# Altium schematic sheet MCU152A_USB_and_Power.SchDoc
size 431 x 279 mm; Date: Not shown in title block; ApprovedBy: Not shown in title block; CheckedBy: Not shown in title block; Author: Not shown in title block; CompanyName: Not shown in title block; Engineer: Not shown in title block; Organization: Not shown in title block; Address1: Not shown in title block; Address2: Not shown in title block; Address3: Not shown in title block; Address4: Not shown in title block; DocumentNumber: 6; Revision: Use project parameter SCH_Rev; SheetNumber: 6; SheetTotal: 8; PageSetup: Record=PageOptions|CenterHorizontal=True|CenterVertical=True|PrintScale=1.00|XCorrection=1.00|YCorrection=1.00|PrintKind=0|BorderSize=5000000|LeftOffset=0|BottomOffset=0|Orientation=2|PaperLength=1000|PaperWidth=1000|Scale=100|PaperSource=15|PrintQuality=600|MediaType=1|DitherType=10|PaperKind=Letter|PrintScaleMode=1; CurrentTime: Not shown in title block; CurrentDate: Not shown in title block; Time: Not shown in title block; DocumentFullPathAndName: Not shown in title block; DocumentName: Not shown in title block; ModifiedDate: Not shown in title block; ImagePath: Not shown in title block
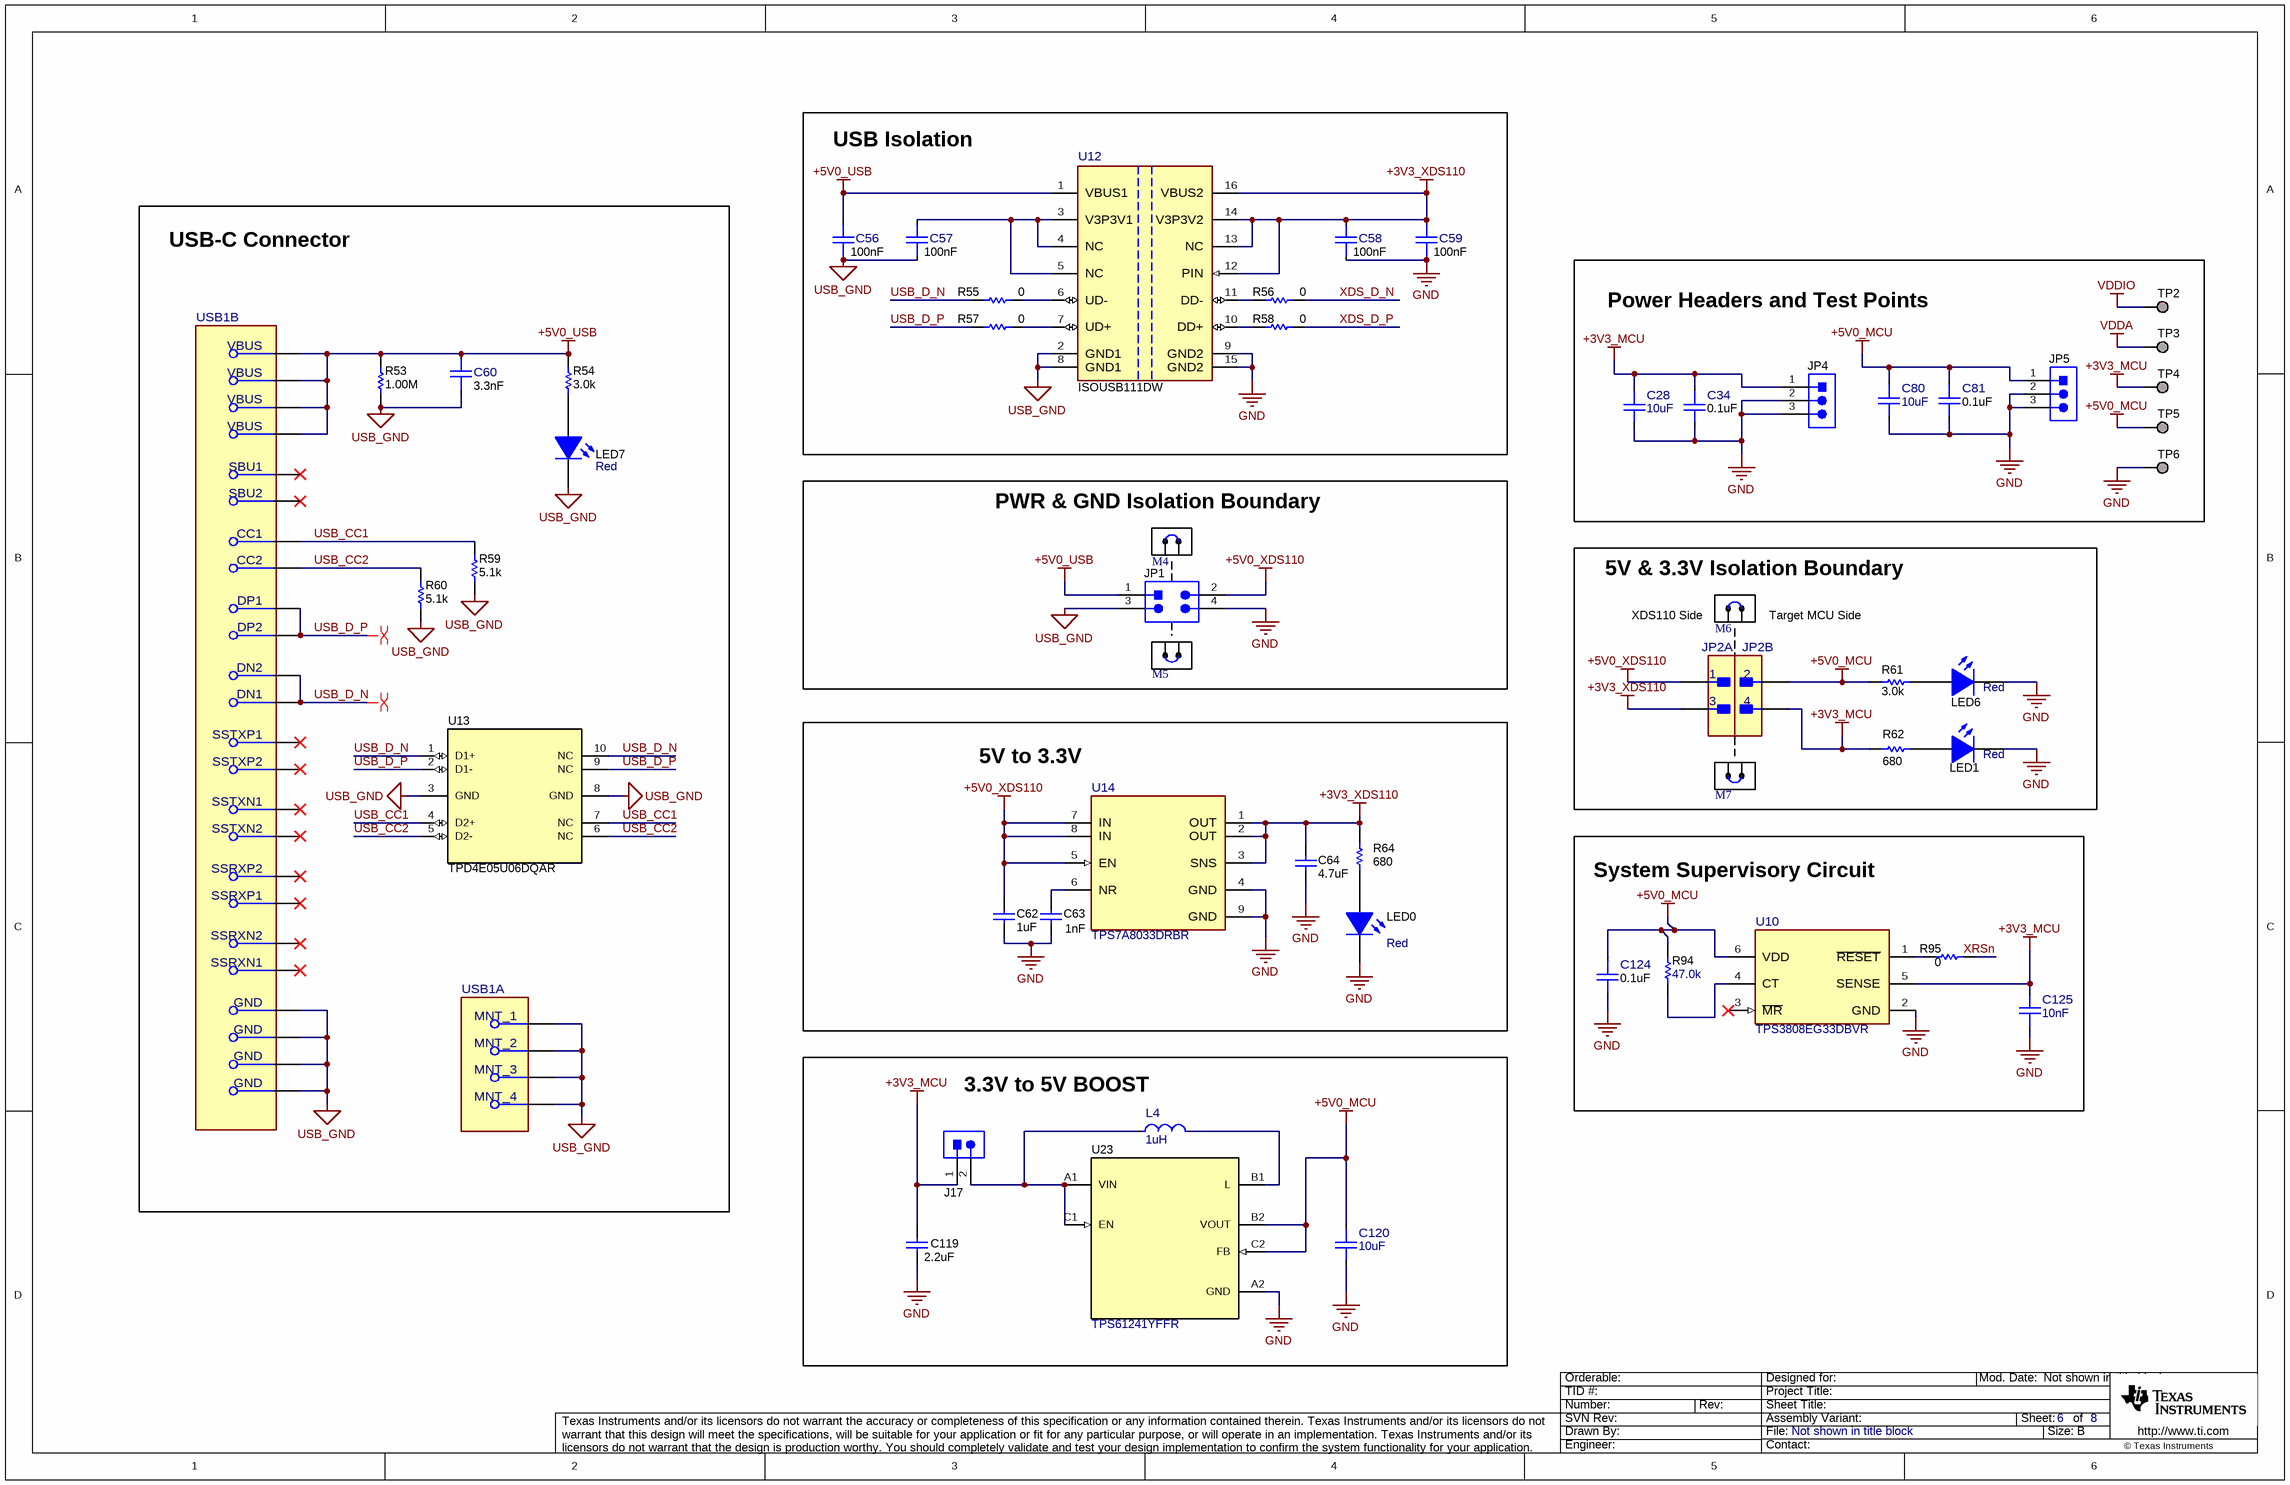
[diagram p0: MCU152A_USB_and_Power.SchDoc]

## Parts
C28  ValueDisplayed: 10uF  [FP-885012106031_0603-MFG]  (hidden comment: 885012106031)
C34  ValueDisplayed: 0.1uF  [FP-885012205018_0402-MFG]  (hidden comment: 885012205018)
C56  Cap_F: 100nF  [FP-885012205018_0402-MFG]  (hidden comment: 885012205018)
C57  Cap_F: 100nF  [FP-885012205018_0402-MFG]  (hidden comment: 885012205018)
C58  Cap_F: 100nF  [FP-885012205018_0402-MFG]  (hidden comment: 885012205018)
C59  Cap_F: 100nF  [FP-885012205018_0402-MFG]  (hidden comment: 885012205018)
C60  ValueDisplayed: 3.3nF  [FP-885012205064_0402-MFG]  (hidden comment: 885012205064)
C62  ValueDisplayed: 1uF  [0402]  (hidden comment: 885012105012)
C63  Cap_F: 1nF  [0402]  (hidden comment: 885012205061)
C64  ValueDisplayed: 4.7uF  [0402_065]  (hidden comment: C1005X5R1A475K050BC)
C80  ValueDisplayed: 10uF  [FP-885012106031_0603-MFG]  (hidden comment: 885012106031)
C81  ValueDisplayed: 0.1uF  [FP-885012205018_0402-MFG]  (hidden comment: 885012205018)
C119  ValueDisplayed: 2.2uF  [0603]  (hidden comment: 885012106018)
C120  ValueDisplayed: 10uF  [FP-885012106031_0603-MFG]  (hidden comment: 885012106031)
C124  ValueDisplayed: 0.1uF  [FP-885012205018_0402-MFG]  (hidden comment: 885012205018)
C125  Cap_F: 10nF  [FP-885012206040_0603-MFG]  (hidden comment: 885012206040)
J17  61300211121  [WURTH_61300211121]  (value not drawn)
JP1  TSM-102-01-L-DV  [Samtec_TSM-102-01-x-DV]  (value not drawn)
JP2  61300421121  [FP-61300421121_HDR4-MFG]  (value not drawn)  (parts A,B of 2)
JP4  61300311121  [WURTH_61300311121]  (value not drawn)
JP5  61300311121  [WURTH_61300311121]  (value not drawn)
L4  value 1uH  [FP-74479773210_0805-MFG]  (hidden comment: 74479773210)
LED0  value Red  [WL-SMCW_RED_0805]  (hidden comment: 150080SS75000)
LED1  value Red  [WL-SMCW_RED_0805]  (hidden comment: 150080SS75000)
LED6  value Red  [WL-SMCW_RED_0805]  (hidden comment: 150080SS75000)
LED7  value Red  [WL-SMCW_RED_0805]  (hidden comment: 150080SS75000)
M4  60900213421  [Wurth_60900213421]  (value not drawn)
M5  60900213421  [Wurth_60900213421]  (value not drawn)
M6  60900213421  [Wurth_60900213421]  (value not drawn)
M7  60900213421  [Wurth_60900213421]  (value not drawn)
R53  ValueDisplayed: 1.00M  [0402]  (hidden comment: CRCW04021M00FKED)
R54  ValueDisplayed: 3.0k  [0603]  (hidden comment: RC0603JR-073KL)
R55  ValueDisplayed: 0  [0402]  (hidden comment: RC0402JR-070RL)
R56  ValueDisplayed: 0  [0402]  (hidden comment: RC0402JR-070RL)
R57  ValueDisplayed: 0  [0402]  (hidden comment: RC0402JR-070RL)
R58  ValueDisplayed: 0  [0402]  (hidden comment: RC0402JR-070RL)
R59  ValueDisplayed: 5.1k  [0603]  (hidden comment: RC0603JR-075K1L)
R60  ValueDisplayed: 5.1k  [0603]  (hidden comment: RC0603JR-075K1L)
R61  ValueDisplayed: 3.0k  [0603]  (hidden comment: RC0603JR-073KL)
R62  ValueDisplayed: 680  [0402]  (hidden comment: CRCW0402680RJNED)
R64  ValueDisplayed: 680  [0402]  (hidden comment: CRCW0402680RJNED)
R94  ValueDisplayed: 47.0k  [0603]  (hidden comment: RC0603FR-0747KL)
R95  ValueDisplayed: 0  [0603]  (hidden comment: ERJ-3GEY0R00V)
TP2  TESTPOINT  [TP_50MIL-25MILHOLE]  (value not drawn)  (no BOM)
TP3  TESTPOINT  [TP_50MIL-25MILHOLE]  (value not drawn)  (no BOM)
TP4  TESTPOINT  [TP_50MIL-25MILHOLE]  (value not drawn)  (no BOM)
TP5  TESTPOINT  [TP_50MIL-25MILHOLE]  (value not drawn)  (no BOM)
TP6  TESTPOINT  [TP_50MIL-25MILHOLE]  (value not drawn)  (no BOM)
U10  TPS3808EG33DBVR  [DBV0006A-MFG]
U12  ISOUSB111DW  [DW0016B-MFG]
U13  TPD4E05U06DQAR  [DQA0010A]
U14  TPS7A8033DRBR  [DRB0008A-MFG]
U23  TPS61241YFFR  [YFF0006AEAE]
USB1  MUP-U22001  [FP-MUP-U22001_CONN_USB_8MM94_8MM0-MFG]  (value not drawn)  (parts A,B of 2)

## Blocks framed on the sheet
USB Isolation: C56-C59 R55-R58 U12
USB-C Connector: C60 LED7 R53 R54 R59 R60 U13 USB1
Power Headers and Test Points: C28 C34 C80 C81 JP4 JP5 TP2-TP6
PWR & GND Isolation Boundary: JP1 M4 M5
5V & 3.3V Isolation Boundary: JP2 LED1 LED6 M6 M7 R61 R62
5V to 3.3V: C62-C64 LED0 R64 U14
System Supervisory Circuit: C124 C125 R94 R95 U10
3.3V to 5V BOOST: C119 C120 J17 L4 U23

## Nets
+3V3_MCU: C28.1 C34.1 C119.1 C125.2 J17.1 JP2.4 JP4.1 R62.2 TP4.1 U10.5(SENSE)
+3V3_XDS110: C58.2 C59.2 C64.1 JP2.3 R64.2 U12.12(PIN) U12.13(NC) U12.14(V3P3V2) U12.16(VBUS2) U14.1(OUT) U14.2(OUT) U14.3(SNS)
+5V0_MCU: C80.1 C81.1 C120.1 C124.1 JP2.2 JP5.1 R61.2 R94.2 TP5.1 U10.6(VDD) U23.B2(VOUT) U23.C2(FB)
+5V0_USB: C56.2 C60.2 JP1.1 R53.2 R54.2 U12.1(VBUS1) USB1.A4(VBUS) USB1.A9(VBUS) USB1.B4(VBUS) USB1.B9(VBUS)
+5V0_XDS110: C62.1 JP1.2 JP2.1 U14.5(EN) U14.7(IN) U14.8(IN)
GND: C28.2 C34.2 C58.1 C59.1 C62.2 C63.2 C64.2 C80.2 C81.2 C119.2 C120.2 C124.2 C125.1 JP1.4 JP4.2 JP4.3 JP5.2 JP5.3 LED0.1(K) LED1.1(K) LED6.1(K) TP6.1 U10.2(GND) U12.9(GND2) U12.15(GND2) U14.4(GND) U14.9(GND) U23.A2(GND)
USB_GND: C56.1 C57.1 C60.1 JP1.3 LED7.1(K) R53.1 R59.1 R60.1 U12.2(GND1) U12.8(GND1) U13.3(GND) U13.8(GND) USB1.1(MNT_1) USB1.2(MNT_2) USB1.3(MNT_3) USB1.4(MNT_4) USB1.A1(GND) USB1.A12(GND) USB1.B1(GND) USB1.B12(GND)
VDDA: TP3.1
VDDIO: TP2.1
USB_CC1: R59.2 U13.4(D2+) U13.7(NC) USB1.A5(CC1)
USB_CC2: R60.2 U13.5(D2-) U13.6(NC) USB1.B5(CC2)
USB_D_N: R55.1 U13.1(D1+) U13.10(NC) USB1.A7(DN1) USB1.B7(DN2)
USB_D_P: R57.1 U13.2(D1-) U13.9(NC) USB1.A6(DP1) USB1.B6(DP2)
XDS_D_N: R56.2
XDS_D_P: R58.2
XRSn: R95.1
NetC57_2: C57.2 U12.3(V3P3V1) U12.4(NC) U12.5(NC)
NetC63_1: C63.1 U14.6(NR)
NetJ17_2: J17.2 L4.1 U23.A1(VIN) U23.C1(EN)
NetL4_2: L4.2 U23.B1(L)
NetLED0_2: LED0.2(A) R64.1
NetLED1_2: LED1.2(A) R62.1
NetLED6_2: LED6.2(A) R61.1
NetLED7_2: LED7.2(A) R54.1
NetR55_2: R55.2 U12.6(UD-)
NetR56_1: R56.1 U12.11(DD-)
NetR57_2: R57.2 U12.7(UD+)
NetR58_1: R58.1 U12.10(DD+)
NetR94_1: R94.1 U10.4(CT)
NetR95_2: R95.2 U10.1(~{RESET})

Not connected (* = marked no-connect by the designer): U10 3(~{MR})*; USB1 A2(SSTXP1)* A3(SSTXN1)* A8(SBU1)* A10(SSRXN2)* A11(SSRXP2)* B2(SSTXP2)* B3(SSTXN2)* B8(SBU2)* B10(SSRXN1)* B11(SSRXP1)*

## Layout directives
differential pair: USB_D_N, USB_D_P

## Notes on the sheet
- XDS110 Side
- (near M6) Target MCU Side
- Drawn By:
- SVN Rev:
- Number:
- TID #:
- Orderable:
- Rev:
- Sheet Title:
- File:
- Project Title:
- Designed for:
- Assembly Variant:
- Mod. Date:
- Sheet:
- Size:
- of
- B
- http://www.ti.com
- Texas Instruments and/or its licensors do not warrant the accuracy or completeness of this specification or any information contained therein. Texas Instruments and/or its licensors do not warrant that this design will meet the specifications, will be suitable for your application or fit for any particular purpose, or will operate in an implementation. Texas Instruments and/or its licensors do not warrant that the design is production worthy. You should completely validate and test your design implementation to confirm the system functionality for your application.
- Engineer:
- Contact:
- © Texas Instruments

## Library data of the parts
C28 C80 C120 = CMP-0124926-1: 10 µF ±20% 25V Ceramic Capacitor X5R 0603 (1608 Metric); Manufacturer: Wurth; AEC Qualified: No; Cap_F: 10µF; SizeZ_mm: 1mm; TempCo: 15%; Value: 10µF; PackageReference: 0603; PartNumber: 885012106031; RoHS: TRUE; Tolerance_%: 20%; VDC_V: 25V; Part Number: 885012106031; datasheet: https://www.we-online.com/katalog/datasheet/885012106031.pdf; Datasheet Path: datasheets/Cap-885012106031.pdf; helpURL: https://upverter.com/upn/revision/3eb71e8268f7dbaa/; Lead Free: Yes; Operating Temperature Range: -55°C to +85°C; Temperature Characteristic: X5R; ComponentLink1Description: Datasheet; ComponentLink1URL: https://www.we-online.com/katalog/datasheet/885012106031.pdf
C34 C81 C124 = CMP-0090362-1: 0.1µF ±10% 10V Ceramic Capacitor X7R 0402 (1005 Metric); Manufacturer: Wurth Electronics; AEC Qualified: No; Value: 100nF; SizeZ_mm: 0.55mm; TempCo: 15%; RoHS: TRUE; Tolerance_%: 10%; datasheet: https://www.we-online.com/catalog/datasheet/885012205018.pdf; Lead Free: Yes; Operating Temperature Range: -55°C to +125°C; ComponentLink1Description: Datasheet; Digikey Description: CAP CER 0.1UF 10V X7R 0402; Supplier Part Number 1: 732-7513-1-ND; Supplier 2: Mouser; Mouser Part Number: 710-885012205018; Digikey Part Number: 732-7513-1-ND; Temperature Characteristic: X7R; Supplier 1: Digikey; Datasheet Path: datasheets/Cap-885012205018.pdf; ComponentLink1URL: https://www.we-online.com/catalog/datasheet/885012205018.pdf; VDC_V: 10V; Supplier Part Number 2: 710-885012205018; Cap_F: 100nF; PackageReference: 0402; PartNumber: 885012205018; Part Number: 885012205018; helpURL: https://upverter.com/upn/revision/1acbe355db19639d/
C56-C59 = CMP-0090362-1: 0.1µF ±10% 10V Ceramic Capacitor X7R 0402 (1005 Metric); Manufacturer: Wurth Electronics; AEC Qualified: No; Value: 100nF; SizeZ_mm: 0.55mm; ValueDisplayed: 100000pF; TempCo: 15%; RoHS: TRUE; Tolerance_%: 10%; datasheet: https://www.we-online.com/catalog/datasheet/885012205018.pdf; Lead Free: Yes; Operating Temperature Range: -55°C to +125°C; ComponentLink1Description: Datasheet; Digikey Description: CAP CER 0.1UF 10V X7R 0402; Supplier Part Number 1: 732-7513-1-ND; Supplier 2: Mouser; Mouser Part Number: 710-885012205018; Digikey Part Number: 732-7513-1-ND; Temperature Characteristic: X7R; Supplier 1: Digikey; Datasheet Path: datasheets/Cap-885012205018.pdf; ComponentLink1URL: https://www.we-online.com/catalog/datasheet/885012205018.pdf; VDC_V: 10V; Supplier Part Number 2: 710-885012205018; PackageReference: 0402; PartNumber: 885012205018; Part Number: 885012205018; helpURL: https://upverter.com/upn/revision/1acbe355db19639d/
C60 = CMP-0092424-1: Cap Cer 3300pF 50V X7R 0402; Manufacturer: Wurth Electronics; TempCo: 15%; AEC Qualified: No; Value: 3.3nF; SizeZ_mm: 0.55mm; Tolerance_%: 10%; Part Number: 885012205064; Supplier 2: Mouser; RoHS: TRUE; Lead Free: Yes; ComponentLink1Description: Datasheet; Cap_F: 3.3nF; Supplier 1: Digikey; Digikey Description: CAP CER 3300PF 50V X7R 0402; Digikey Part Number: 732-7559-1-ND; Temperature Characteristic: X7R; Operating Temperature Range: -55°C to +125°C; Supplier Part Number 2: 710-885012205064; Datasheet Path: datasheets/Cap-885012205064.pdf; datasheet: https://www.we-online.com/catalog/datasheet/885012205064.pdf; helpURL: https://upverter.com/upn/revision/78c7421d1fb19545/; Supplier Part Number 1: 732-7559-1-ND; Mouser Part Number: 710-885012205064; PackageReference: 0402; PartNumber: 885012205064; ComponentLink1URL: https://www.we-online.com/catalog/datasheet/885012205064.pdf; VDC_V: 50V
C62 = CMP-0064924-2: CAP, CERM, 1 uF, 10 V,+/- 20%, X5R, 0402; Manufacturer: Wurth Elektronik; Polarized: N; Value: 1uF; U/M: EA; Cap_F: 1µF; Value1: Unknown; VDC_V: 10V; TaMin_C: -55°C; TaMax_C: 85°C; SizeArea_mm2: 0.5; SizeAreaWB_mm2: 3; SizeX_mm: 1; SizeZ_mm: 0.6; AEC Category: Q200; CompType: Capacitor; PartNumber: 885012105012; PackageReference: 0402; RoHS: Y; Tolerance_%: 20%; Value2: 10V; MountType: SMT; Technology: Ceramic; TempCo: X5R; Cap_Case: 0402; SizeY_mm: 0.5; Published: 2008-06-19; Publisher: Texas Instruments; LatestRevisionDate: 2017-06-05; ComponentLink1Description: Datasheet link; ComponentLink1URL: http://katalog.we-online.de/pbs/datasheet/885012105012.pdf; Supplier 1: Digi-Key; Supplier Part Number 1: 732-7489-1-ND; Supplier 2: Newark; Supplier Part Number 2: 75Y5997; Supplier 3: Mouser; Supplier Part Number 3: 710-885012105012; AEC Qualified: N; AEC Grade: N/A
C63 = CMP-0006231-2: CAP, CERM, 1000 pF, 50 V, +/- 10%, X7R, 0402; Manufacturer: Wurth Elektronik; Polarized: N; Value: 1000pF; U/M: EA; Value1: Unknown; VDC_V: 50V; TaMin_C: -55°C; TaMax_C: 125°C; SizeArea_mm2: 0.5; SizeAreaWB_mm2: 3; SizeX_mm: 1; SizeZ_mm: 0.6; AEC Category: Q200; CompType: Capacitor; PartNumber: 885012205061; ValueDisplayed: 1000pF; PackageReference: 0402; RoHS: Y; Tolerance_%: 10%; Value2: 50V; MountType: SMT; Technology: Ceramic; TempCo: X7R; Cap_Case: 0402; SizeY_mm: 0.5; Published: 2008-06-19; Publisher: Texas Instruments; LatestRevisionDate: 2017-03-09; ComponentLink1Description: Datasheet link; ComponentLink1URL: http://katalog.we-online.de/pbs/datasheet/885012205061.pdf; Supplier 1: Digi-Key; Supplier Part Number 1: 732-7556-1-ND; Supplier 2: Mouser; Supplier Part Number 2: 710-885012205061; AEC Qualified: N; AEC Grade: N/A
C64 = CMP-0006268-2: CAP, CERM, 4.7 uF, 10 V, +/- 10%, X5R, 0402; Manufacturer: TDK; TaMin_C: -55°C; ESR_ohm: 3.417m; Polarized: N; SizeAreaWB_mm2: 3; Value1: 0.003417 ohm; U/M: EA; Value: 4.7uF; TaMax_C: 85°C; SizeZ_mm: 0.65; SizeX_mm: 1; SizeY_mm: 0.5; Value2: 10V; Cap_F: 4.7µF; IRMS_A: 2.7063A; AEC Category: Q200; Supplier Part Number 2: 29X4772; Publisher: Texas Instruments; Supplier 2: Newark; Supplier Part Number 3: 810-C1005X5R1A475KBC; TempCo: X5R; Supplier 3: Mouser; Published: 2008-06-19; RoHS: Y; MountType: SMT; Supplier 1: Digi-Key; PackageReference: 0402; Tolerance_%: 10%; Cap_Case: 0402_065; SizeArea_mm2: 0.5; CompType: Capacitor; LatestRevisionDate: 2017-03-09; PartNumber: C1005X5R1A475K050BC; AEC Qualified: N; VDC_V: 10V; ComponentLink1Description: Datasheet link; AEC Grade: N/A; Supplier Part Number 1: 445-13820-1-ND; Technology: Ceramic; ComponentLink1URL: https://product.tdk.com/en/search/capacitor/ceramic/mlcc/info?part_no=C1005X5R1A475K050BC
C119 = CMP-0006825-5: CAP, CERM, 2.2 uF, 16 V, +/- 20%, X5R, 0603; Manufacturer: Wurth Elektronik; TaMin_C: -55°C; Polarized: N; SizeAreaWB_mm2: 4.68; Value1: Unknown; U/M: EA; Value: 2.2uF; TaMax_C: 85°C; SizeZ_mm: 1; SizeX_mm: 1.6; SizeY_mm: 0.8; Value2: 16V; SizeArea_mm2: 1.28; Cap_F: 2.2µF; AEC Category: Q200; Supplier Part Number 2: 710-885012106018; Publisher: Texas Instruments; Supplier 2: Mouser; TempCo: X5R; Published: 2008-06-19; RoHS: Y; MountType: SMT; Supplier 1: Digi-Key; PackageReference: 0603; Tolerance_%: 20%; Cap_Case: 0603; CompType: Capacitor; LatestRevisionDate: 2017-03-09; PartNumber: 885012106018; AEC Qualified: N; VDC_V: 16V; ComponentLink1Description: Datasheet link; AEC Grade: N/A; Supplier Part Number 1: 732-7915-1-ND; Technology: Ceramic; ComponentLink1URL: http://katalog.we-online.de/pbs/datasheet/885012106018.pdf
C125 = CMP-0124908-1: 10000 pF ±10% 16V Ceramic Capacitor X7R 0603 (1608 Metric); Manufacturer: Wurth; AEC Qualified: No; SizeZ_mm: 0.87mm; TempCo: 15%; Value: 10nF; PackageReference: 0603; PartNumber: 885012206040; RoHS: TRUE; Supplier 1: Digikey; Supplier 2: Mouser; Supplier Part Number 1: 732-7959-1-ND; Supplier Part Number 2: 710-885012206040; Tolerance_%: 10%; ValueDisplayed: 10nF; VDC_V: 16V; Part Number: 885012206040; datasheet: https://www.we-online.com/components/products/datasheet/885012206040.pdf; Datasheet Date: 2021-01-03; Datasheet Path: datasheets/Cap-885012206040.pdf; Datasheet Version: 002.000; Digikey Description: CAP CER 10000PF 16V X7R 0603; Digikey Part Number: 732-7959-1-ND; helpURL: https://upverter.com/upn/revision/21efeea95ee0341e/; Lead Free: Yes; Mouser Description: 10nF Multilayer Ceramic Capacitor MLCC 16 V; X7R Dielectric 0603 Surface Mount; Mouser Part Number: 710-885012206040; Operating Temperature Range: -55°C to +125°C; Temperature Characteristic: X7R; ComponentLink1Description: Datasheet; ComponentLink1URL: https://www.we-online.com/components/products/datasheet/885012206040.pdf
J17 = CMP-0054794-2: Header, 2.54 mm, 2x1, Gold, TH; Manufacturer: Wurth Elektronik; Shrouded: N; Gender: Male; Green_REACh: Passed; Pitch_mm: 2.54; Green_Lifecycle: Active; Row_Count: 1; Cert_UL: Y; Supplier Part Number 2: 20X0948; Orientation: Vertical; PinCount: 2; ClassName: Header; Supplier 2: Newark; PackageReference: Header, 2.54mm, 2x1, TH; CompType: Header; ComponentLink1Description: Datasheet URL; Supplier 1: Digi-Key; Green_EU RoHS-2: Incomplete; ComponentLink1URL: http://katalog.we-online.de/em/datasheet/6130xx11121.pdf; Green_EU RoHS: Passed; MountType: TH; Supplier Part Number 3: 710-61300211121; RoHS: Y; Supplier Part Number 1: 732-5315-ND; ContactFinish: Gold; Supplier 3: Mouser; PartNumber: 61300211121; Color: Black
JP1 = CMP-0055559-1: Header, 2.54mm, 2x2, Gold, SMT; Manufacturer: Samtec; CNHeader: TRUE; Shrouded: N; Gender: Male; Cert_CSA: Y; Voltage_V: 475V; Row_Count: 2; Pitch_mm: 2.54; CT: FALSE; ComponentLink1URL: http://suddendocs.samtec.com/catalog_english/tsm.pdf; ClassName: Header; Supplier Part Number 2: 27C2242; Publisher: Texas Instruments; Supplier 2: Newark; Supplier Part Number 3: 1803290; Color: Black; Supplier 3: Farnell; RoHS: Y; MountType: SMT; Supplier 1: Digi-Key; PackageReference: Header, 2.54mm, 2x2, SMT; PinCount: 4; CompType: Header; LatestRevisionDate: 26/05/2017; PartNumber: TSM-102-01-L-DV; Orientation: Vertical; ComponentLink1Description: Datasheet URL; Supplier Part Number 1: TSM-102-01-L-DV-ND; ContactFinish: Gold; Cert_UL: Y
JP2 = CMP-0092422-1: THT Vertical Pin Header WR-PHD, Pitch 2.54 mm, Dual Row, 4 pins; Manufacturer: Wurth Electronics; DUT-Pitch_mm: 2.54mm; SizeZ_mm: 8.89mm; Voltage_V: 250V; Conn Gender: Male; AEC Qualified: No; Row_Count: 2; ContactFinish: Gold; Conn Orientation: Straight; Current_A: 3A; Supplier Part Number 2: 710-61300421121; Supplier 1: Digikey; Mouser Part Number: 710-61300421121; Operating Temperature Range: -40°C to +105°C; ComponentLink1URL: https://www.we-online.com/catalog/datasheet/61300421121.pdf; Lead Free: Yes; PinCount: 4; Supplier Part Number 1: 732-5294-ND; Part Number: 61300421121; RoHS: TRUE; Digikey Part Number: 732-5294-ND; Is Female: no; Digikey Description: CONN HEADER VERT 4POS 2.54MM; datasheet: https://www.we-online.com/catalog/datasheet/61300421121.pdf; PartNumber: 61300421121; Supplier 2: Mouser; Datasheet Path: datasheets/Conn-61300421121.pdf; PackageReference: HDR4; helpURL: https://upverter.com/upn/revision/de171c811246619e/; ComponentLink1Description: Datasheet
JP4 JP5 = CMP-0054796-1: Header, 2.54 mm, 3x1, Gold, TH; Manufacturer: Wurth Elektronik; Green_Lifecycle: Active; Green_REACh: Passed; CNHeader: TRUE; CT: FALSE; PartNumber: 61300311121; PackageReference: Header, 2.54mm, 3x1, TH; ClassName: Header; CompType: Header; RoHS: Y; MountType: TH; ComponentLink1Description: Datasheet URL; ComponentLink1URL: http://katalog.we-online.de/em/datasheet/6130xx11121.pdf; Publisher: Texas Instruments; LatestRevisionDate: 26/05/2017; Supplier 1: Digi-Key; Supplier Part Number 1: 732-5316-ND; Supplier 2: Newark; Supplier Part Number 2: 20X0950; Supplier 3: Farnell; Supplier Part Number 3: 356154; Green_EU RoHS: Passed; Green_EU RoHS-2: Incomplete
L4 = CMP-0124907-1: Inductor Power Shielded Multi-Layer 1uH 20% 1MHz 14Q-Factor Powdered Iron 1.2A 180mOhm DCR 0805 T/R; Manufacturer: Wurth; AEC Qualified: No; DCR_ohm: 0.225; Ind_H: 1µH; Irms: 1200mA; Isat: 800mA; SizeZ_mm: 0.6mm; Q Factor: 14; Self Resonant Frequency: 90MHz; TaMax_C: +85°C; TaMin_C: -40°C; PackageReference: 0805; PartNumber: 74479773210; RoHS: TRUE; Supplier 1: Digikey; Supplier 2: Mouser; Supplier Part Number 1: 732-5056-1-ND; Supplier Part Number 2: 710-74479773210; Technology: Multilayer; Part Number: 74479773210; datasheet: https://www.we-online.com/components/products/datasheet/74479773210.pdf; Datasheet Date: 2019-05-07; Datasheet Path: datasheets/Ind-74479773210.pdf; Datasheet Version: 001.003; Digikey Description: FIXED IND 1UH 1.2A 180 MOHM SMD; Digikey Part Number: 732-5056-1-ND; helpURL: https://upverter.com/upn/revision/58396f33807941a6/; Lead Free: Yes; Mouser Description: Inductor Power Shielded Multi-Layer 1uH 20% 1MHz 14Q-Factor Powdered Iron 1.2A 180mOhm DCR 0805 T/R; Mouser Part Number: 710-74479773210; Operating Temperature Range: -40°C to +125°C; Test Frequency: 1MHz; Tolerance_%: 20%; ComponentLink1Description: Datasheet; ComponentLink1URL: https://www.we-online.com/components/products/datasheet/74479773210.pdf
LED0 LED1 LED6 LED7 = CMP-0002951-3: LED, Red, SMD; Manufacturer: Wurth Elektronik; Type: AlInGaP; Vf_V: 1.9V; Io_A: 30mA; Vr_V: 5V; Ir_A: 25µA; Tjmax_C: 85°C; Power_TotalModule: 72mW; Value1: 0.072W; Angle: 140; CompType: LED; PartNumber: 150080SS75000; MountType: SMT; RoHS: Y; PackageReference: LED_0805; Value2: 1.9V; Color: Red; ComponentLink1URL: http://katalog.we-online.de/led/datasheet/150080SS75000.pdf; ComponentLink1Description: Datasheet link
M4-M7 = CMP-0003761-2: Shunt, 2.54mm, Gold, Black; Manufacturer: Wurth Elektronik; ComponentLink1URL: http://katalog.we-online.de/em/datasheet/60900213421.pdf; Supplier Part Number 2: 16T0609; Supplier 3: Mouser; Supplier 1: Digi-Key; CompType: Shunt; PackageReference: Shunt, 2.54mm, Black; RoHS: Y; Supplier Part Number 1: 732-2678-ND; Supplier Part Number 3: 710-60900213421; Supplier 2: Newark; MountType: N/A; PartNumber: 60900213421; ComponentLink1Description: Datasheet Link; ClassName: Shunt
R53 = CMP-0026100-2: RES, 1.00 M, 1%, 0.063 W, AEC-Q200 Grade 0, 0402; Manufacturer: Vishay-Dale; Value: 1.00Meg; Res_ohm: 1M; Value_Code: 1M00; Power_W: 63mW; Value2: 0.063W; VDC_V: 50V; TempCo: 100 ppm/C; SizeArea_mm2: 0.5; SizeX_mm: 1; SizeZ_mm: 0.6; EIA_Code: E96; AEC Category: Q200; AEC Qualified: Y; AEC Grade: 0; CompType: Resistor; PartNumber: CRCW04021M00FKED; PackageReference: 0402; RoHS: E; Tolerance_%: 1%; Value1: 1%; MountType: SMT; Technology: Thick Film; SizeY_mm: 0.5; ComponentLink1Description: Datasheet link; ComponentLink1URL: http://www.vishay.com/docs/20035/dcrcwe3.pdf; Supplier 1: Digi-Key; Supplier Part Number 1: 541-1.00MLCT-ND; Supplier 2: Newark; Supplier Part Number 2: 52K6593; Supplier 3: Mouser; Supplier Part Number 3: 71-CRCW0402-1.0M-E3
R54 R61 = CMP-0025921-5: RES, 3.0 k, 5%, 0.1 W, 0603; Manufacturer: Yageo; Power_W: 100mW; TempCo: 100 ppm/C; Value_Code: 3k00; Value: 3.0k; EIA_Code: E24; Res_ohm: 3k; SizeX_mm: 1.6; SizeY_mm: 0.8; SizeZ_mm: 1; Value2: 0.1W; SizeArea_mm2: 1.28; AEC Qualified: N; VDC_V: 75V; AEC Category: Q200; SizeAreaWB_mm2: 4.68; Supplier Part Number 2: 603-RC0603JR-073KL; Supplier 2: Mouser; Supplier Part Number 3: 1799415; Supplier 3: Farnell; RoHS: Y; Value1: 5%; MountType: SMT; Supplier 1: Digi-Key; PackageReference: 0603; Tolerance_%: 5%; CompType: Resistor; PartNumber: RC0603JR-073KL; ComponentLink1Description: Datasheet link; Supplier Part Number 1: 311-3.0KGRCT-ND; Technology: Thick Film; ComponentLink1URL: http://www.yageo.com/pdf/Pu-RC0603_51_PbFree_L_2.pdf; AEC Grade: N/A
R55-R58 = CMP-0027004-2: RES, 0, 5%, 0.063 W, 0402; Manufacturer: Yageo America; Power_W: 63mW; TempCo: 200 ppm/C; Value_Code: 0000; U/M: EA; Value: 0; EIA_Code: E24; SizeX_mm: 1; SizeY_mm: 0.5; SizeZ_mm: 0.6; Value2: 0.063W; VDC_V: 50V; AEC Category: Q200; Supplier Part Number 2: 603-RC0402JR-070RL; Publisher: Texas Instruments; Supplier 2: Mouser; Supplier Part Number 3: 9232516; Supplier 3: Farnell; Published: 2008-06-26; RoHS: Y; Value1: 5%; MountType: SMT; Supplier 1: Digi-Key; PackageReference: 0402; Tolerance_%: 5%; Res_ohm: 0; SizeArea_mm2: 0.5; CompType: Resistor; LatestRevisionDate: 2017-03-09; PartNumber: RC0402JR-070RL; AEC Qualified: ?; ComponentLink1Description: Datasheet link; Supplier Part Number 1: 311-0.0JRCT-ND; Technology: Thick Film; ComponentLink1URL: http://www.yageo.com/pdf/Pu-RC0402_51_PbFree_L_2.pdf
R59 R60 = CMP-0025932-5: RES, 5.1 k, 5%, 0.1 W, 0603; Manufacturer: Yageo; Power_W: 100mW; TempCo: 100 ppm/C; Value_Code: 5k10; Value: 5.1k; EIA_Code: E24; SizeX_mm: 1.6; SizeY_mm: 0.8; SizeZ_mm: 1; Value2: 0.1W; SizeArea_mm2: 1.28; AEC Qualified: N; VDC_V: 75V; AEC Category: Q200; SizeAreaWB_mm2: 4.68; Supplier Part Number 2: 603-RC0603JR-075K1L; Supplier 2: Mouser; Supplier Part Number 3: 1799436; Supplier 3: Farnell; RoHS: Y; Value1: 5%; MountType: SMT; Supplier 1: Digi-Key; PackageReference: 0603; Tolerance_%: 5%; Res_ohm: 5.1k; CompType: Resistor; PartNumber: RC0603JR-075K1L; ComponentLink1Description: Datasheet link; Supplier Part Number 1: 311-5.1KGRCT-ND; Technology: Thick Film; ComponentLink1URL: http://www.yageo.com/pdf/Pu-RC0603_51_PbFree_L_2.pdf; AEC Grade: N/A
R62 R64 = CMP-0026962-3: RES, 680, 5%, 0.063 W, AEC-Q200 Grade 0, 0402; Manufacturer: Vishay-Dale; Power_W: 63mW; TempCo: 200 ppm/C; Value_Code: 680R; Value: 680; EIA_Code: E24; SizeX_mm: 1; SizeY_mm: 0.5; SizeZ_mm: 0.6; Value2: 0.063W; AEC Qualified: Y; VDC_V: 50V; AEC Category: Q200; AEC Grade: 0; Supplier Part Number 2: 59M6744; Supplier 2: Newark; Supplier Part Number 3: 71-CRCW0402J-680-E3; Supplier 3: Mouser; RoHS: E; Value1: 5%; MountType: SMT; Supplier 1: Digi-Key; PackageReference: 0402; Tolerance_%: 5%; Res_ohm: 680; SizeArea_mm2: 0.5; CompType: Resistor; PartNumber: CRCW0402680RJNED; ComponentLink1Description: Datasheet link; Supplier Part Number 1: 541-680JCT-ND; Technology: Thick Film; ComponentLink1URL: http://www.vishay.com/docs/20035/dcrcwe3.pdf
R94 = CMP-0023133-5: RES, 47.0 k, 1%, 0.1 W, 0603; Manufacturer: Yageo; Power_W: 100mW; TempCo: 100 ppm/C; Value_Code: 47k0; Value: 47.0k; Res_ohm: 47k; SizeX_mm: 1.6; SizeY_mm: 0.8; SizeZ_mm: 1; Value2: 0.1W; SizeArea_mm2: 1.28; AEC Qualified: N; VDC_V: 75V; AEC Category: Q200; SizeAreaWB_mm2: 4.68; Supplier Part Number 2: 603-RC0603FR-0747KL; Supplier 2: Mouser; Supplier Part Number 3: 9238689; Supplier 3: Farnell; RoHS: Y; Value1: 1%; MountType: SMT; Supplier 1: Digi-Key; PackageReference: 0603; Tolerance_%: 1%; CompType: Resistor; PartNumber: RC0603FR-0747KL; ComponentLink1Description: Datasheet link; Supplier Part Number 1: 311-47.0KHRCT-ND; Technology: Thick Film; ComponentLink1URL: http://www.yageo.com/pdf/Pu-RC0603_51_PbFree_L_2.pdf; AEC Grade: N/A
R95 = CMP-0025874-4: RES, 0, 5%, 0.1 W, AEC-Q200 Grade 0, 0603; Manufacturer: Panasonic; Power_W: 100mW; TempCo: 600 ppm/C; Value_Code: 0000; Value: 0; EIA_Code: E24; SizeX_mm: 1.6; SizeY_mm: 0.8; SizeZ_mm: 1; Value2: 0.1W; SizeArea_mm2: 1.28; AEC Qualified: Y; VDC_V: 50V; AEC Category: Q200; SizeAreaWB_mm2: 4.68; Supplier Part Number 2: 667-ERJ-3GEY0R00V; Supplier 2: Mouser; Supplier Part Number 3: 2059527; Supplier 3: Farnell; RoHS: Y; Value1: 5%; MountType: SMT; Supplier 1: Digi-Key; PackageReference: 0603; Tolerance_%: 5%; Res_ohm: 0; CompType: Resistor; PartNumber: ERJ-3GEY0R00V; ComponentLink1Description: Datasheet link; Supplier Part Number 1: P0.0GCT-ND; Technology: Thick Film; ComponentLink1URL: https://industrial.panasonic.com/cdbs/www-data/pdf/RDA0000/AOA0000C301.pdf; AEC Grade: 0
TP2-TP6 = CMP-0078143-3: TEST POINT.  No entry in BOM.; CompType: Testpoint; PackageReference: N/A; Manufacturer: N/A; PartNumber: N/A; Library Reference: TESTPOINT
U10 = CMP-0120241-1: Low-quiescent current supervisor with programmable delay and manual reset 6-SOT-23 -40 to 85; Manufacturer: Texas Instruments; SizeZ_mm: 1.45mm; AEC Qualified: No; Max Supply Voltage: 6V; Min Supply Voltage: 1.7V; Nominal Supply Current: 0.6uA; Number Of Outputs: 1; Reset Timeout: 0.02-0.83s; Reset Type: Active Low; Standoff Height: 0mm; Threshold Voltage: 3.07V; TJmax_C: +125°C; PackageReference: SOT23-6; PartNumber: TPS3808EG33DBVR; RoHS: UNKNOWN; Operating Temperature Range: -40°C to +125°C; Part Number: TPS3808EG33DBVR; Datasheet Path: datasheets/IC-TPS3808EG33DBVR.pdf; helpURL: https://upverter.com/upn/revision/ded49741c03c6903/; Number Of Rails Monitored: 1
U12 = CMP-0091303-1: Full/Low Speed Isolated USB Repeater, SOIC16-Wide; Manufacturer: Texas Instruments; Number Of Ports: 1; Usb Standard: USB 2.0; Min Supply Voltage: 3V; Data Rate: 12Mbits/s; Max Supply Voltage: 5.5V; TaMin_C: -40°C; SizeZ_mm: 2.65mm; TaMax_C: +125°C; Nominal Supply Current: 9-9.5mA; TJmax_C: +150°C; Standoff Height: 0.1mm; AEC Qualified: No; Part Number: ISOUSB111DW; Operating Temperature Range: -55°C to +150°C; PackageReference: SOICW16; Datasheet Path: datasheets/IC-ISOUSB111DW.pdf; Interface: USB; helpURL: https://upverter.com/upn/revision/bd93d5af0e7edffb/; RoHS: UNKNOWN; PartNumber: ISOUSB111DW
U13 = CMP-0073613-3: 4-Channel Ultra-Low-Capacitance IEC ESD Protection Diode, DQA0010A (USON-10); Alternate Manufacturer: Texas Instruments; Green_Lifecycle: Active; SizeAreaWB_mm2: 7.0; Green_REACh: Passed; SizeZ_mm: 0.55; SizeX_mm: 1.0; SizeY_mm: 2.5; CompType: IC; AEC Category: Q200; AEC Qualified: N; ComponentLink1URL: http://www.ti.com/lit/ds/symlink/tpd4e05u06.pdf; PackageDescription: USON-10; RoHS: Y; MountType: SMT; Green_EU RoHS-2: Passed; Manufacturer: Texas Instruments; Green_EU RoHS: Passed; PackageReference: DQA0010A; SizeArea_mm2: 2.5; PartNumber: TPD4E05U06DQAR; ComponentLink1Description: Datasheet Link; ComponentLink2Description: Product Folder; ComponentLink2URL: http://www.ti.com/product/tpd4e05u06; ComponentLink3Description: Online Datasheet; ComponentLink3URL: http://www.ti.com/product/tpd4e05u06/datasheet
U14 = CMP-0124913-1: Low-Noise, Wide-Bandwidth, High PSRR, Low-Dropout 1-A Linear Regulator; Manufacturer: Texas Instruments; SizeZ_mm: 1mm; AEC Qualified: No; Dropout Voltage: 500mV; Max Supply Voltage: 6.5V; Min Supply Voltage: 3.8V; Nominal Supply Current: 120uA; Number Of Outputs: 1; Output Type: Fixed; Output Voltage: 3.3V; Standoff Height: 0mm; TJmax_C: +125°C; PackageReference: SON8; PartNumber: TPS7A8033DRBR; RoHS: TRUE; Operating Temperature Range: -40°C to +125°C; Part Number: TPS7A8033DRBR; datasheet: https://www.ti.com/lit/ds/symlink/tps7a80.pdf; Datasheet Date: 2018-01; Datasheet Path: datasheets/IC-TPS7A8033DRBR.pdf; Datasheet Version: SBVS135J; Digikey Description: IC REG LINEAR 3.3V 1A 8SON; Digikey Part Number: 296-52139-1-ND; helpURL: https://upverter.com/upn/revision/a1dbcb9badf49cbb/; Lead Free: Yes; Mouser Part Number: 595-TPS7A8033DRBR; ComponentLink1Description: Datasheet; ComponentLink1URL: https://www.ti.com/lit/ds/symlink/tps7a80.pdf
U23 = CMP-0067212-2: 5V, 500mA, 4MHz Step-Up DC/DC Converter, YFF0006AEAE (DSBGA-6); Alternate Manufacturer: Texas Instruments; Alternate PartNumber: TPS61241YFFT; AEC Qualified: N; Rating: Catalog; SizeX_mm: 0.856; SizeAreaWB_mm2: 4.190848; SizeY_mm: 1.258; SizeArea_mm2: 1.076848; AEC Category: Q200; CompType: IC; SizeZ_mm: 0.625; ComponentLink2URL: http://www.ti.com/product/tps61241; ComponentLink3URL: http://www.ti.com/product/tps61241/datasheet; ComponentLink3Description: Online Datasheet; Operating Temperature Range: -40 to 85 C; PartNumber: TPS61241YFFR; ComponentLink2Description: Product Folder; RoHS: Y; PackageReference: YFF0006AEAE; MountType: SMT; ComponentLink1URL: http://www.ti.com/lit/ds/symlink/tps61241.pdf; Manufacturer: Texas Instruments; ComponentLink1Description: Datasheet Link; PackageDescription: DSBGA-6
USB1 = CMP-0092137-1: Connector, USB Type-C 24 pin Mid Mount dual row Receptacle Surface Mount; Manufacturer: MUP; ContactFinish: Gold,Nickel; Usb Standard: OTHER; AEC Qualified: No; Conn Orientation: Horizontal; Shrouded: true; SizeZ_mm: 2.81mm; Is Female: yes; DUT-Pitch_mm: 0.5mm; Datasheet Path: datasheets/Conn-MUP-U22001.pdf; ComponentLink1URL: http://www.mupconnector.com/product/show/id/525.html; ComponentLink1Description: Datasheet; PartNumber: MUP-U22001; PackageReference: CONN_USB_8MM94_8MM0; helpURL: https://upverter.com/upn/revision/6b0c75e83cbd5706/; Part Number: MUP-U22001; RoHS: TRUE; datasheet: http://www.mupconnector.com/product/show/id/525.html; Lead Free: Yes; Operating Temperature Range: -25°C to +85°C; PinCount: 24